# EAGLE schematic teensy_base (EAGLE 8.5.2)
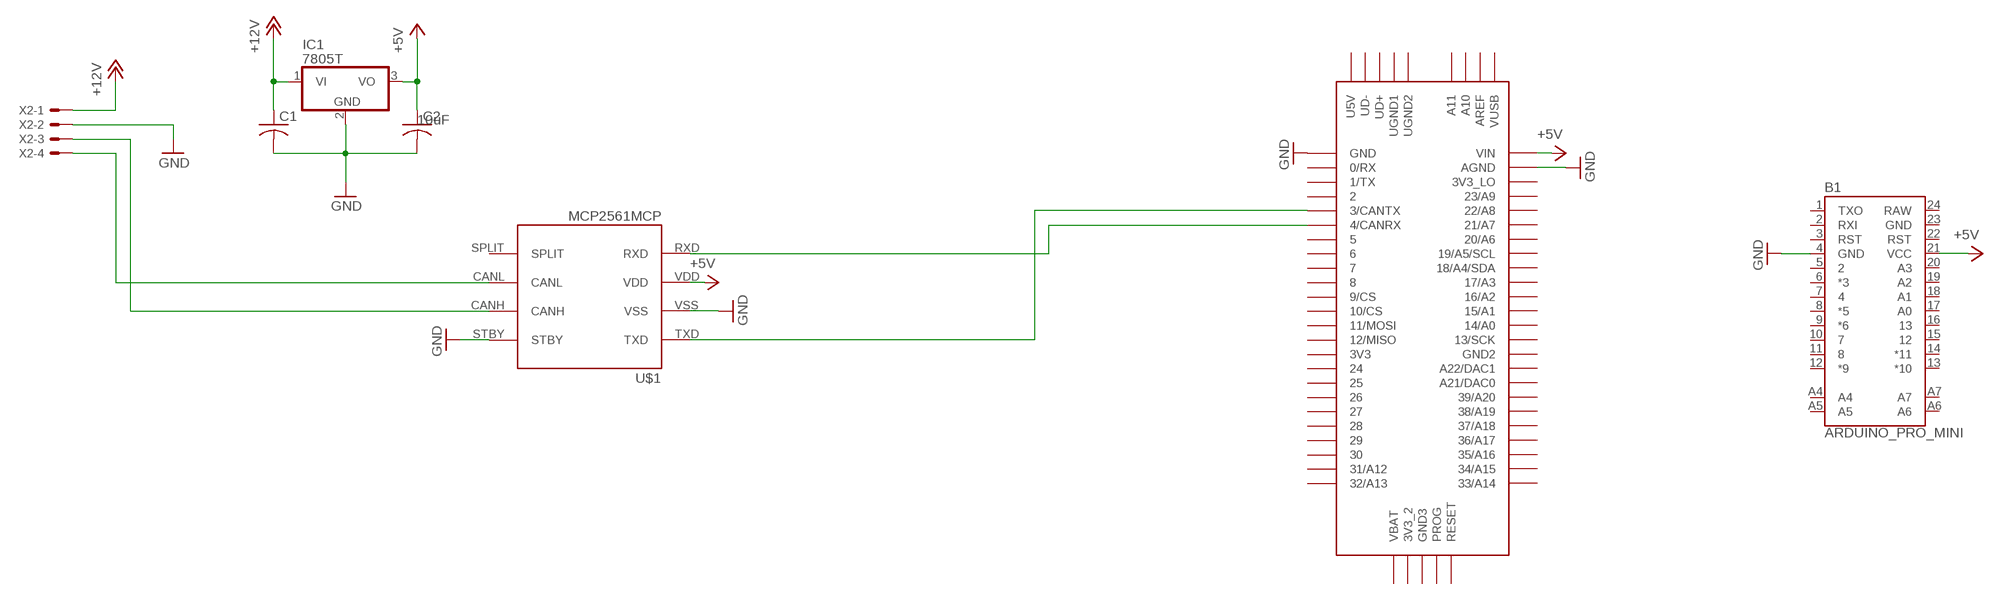
[diagram p0: schematic, sheet 1]

## Parts
B1  ARDUINO_PRO_MINI  [ARDUINO_PRO_MINI]
C1  C-USC1206  [C1206]
C2  C-USC1206  [C1206]
IC1  7805T  [TO220H]
U$1  MCP2561MCP  [MCP2561_PDIP]
U$2  TEENSY_3.5/3.6  [TEENSY_3.5/3.6]
X2  KK-156-4  [KK-156-4]

## Nets
+5V: B1.21(VCC) C2.1 IC1.3(VO) U$1.VDD U$2.VIN
+12V: C1.1 IC1.1(VI) X2.1
GND: B1.4(GND) C1.2 C2.2 IC1.2(GND) U$1.STBY U$1.VSS U$2.AGND U$2.GND X2.2
N$1: U$1.RXD U$2.4/CANRX
N$2: U$1.TXD U$2.3/CANTX
N$5: U$1.CANH X2.3
N$6: U$1.CANL X2.4
Unconnected: B1.1(TXO) B1.2(RXI) B1.3(RST) B1.5 B1.6(*3) B1.7 B1.8(*5) B1.9(*6) B1.10 B1.11 B1.12(*9) B1.13(*10) B1.14(*11) B1.15 B1.16 B1.17(A0) B1.18(A1) B1.19(A2) B1.20(A3) B1.22(RST) B1.A4 B1.A5 B1.A6 B1.A7 U$1.SPLIT U$2.0/RX U$2.1/TX U$2.2 U$2.3V3 U$2.3V3_2 U$2.3V3_LO U$2.5 U$2.6 U$2.7 U$2.8 U$2.9/CS U$2.10/CS U$2.11/MOSI U$2.12/MISO U$2.13/SCK U$2.14/A0 U$2.15/A1 U$2.16/A2 U$2.17/A3 U$2.18/A4/SDA U$2.19/A5/SCL U$2.20/A6 U$2.21/A7 U$2.21/DAC0(A21/DAC0) U$2.22/A8 U$2.23/A9 U$2.24 U$2.25 U$2.26 U$2.27 U$2.28 U$2.29 U$2.30 U$2.31/A12 U$2.32/A13 U$2.33/A14 U$2.34/A15 U$2.35/A16 U$2.36/A17 U$2.37/A18 U$2.38/A19 U$2.39/A20 U$2.A10 U$2.A11 U$2.A22/DAC1 U$2.AREF U$2.GND2 U$2.GND3 U$2.PROG U$2.RESET U$2.U5V U$2.UD+ U$2.UD- U$2.UGND1 U$2.UGND2 U$2.VBAT U$2.VUSB

## Power pins joined to a net without a drawn wire
GND: B1.23(GND)
RAW: B1.24(RAW)

## Library data of the parts
B1 = SparkFun-Boards:ARDUINO_PRO_MINI: SparkFun Pro Mini Pro Mini compatible footprint. Dimensions: 0.7 x 1.3" PCB Thickness: 0.8mm SparkFun Products: 3.3V/8MHz <https://www.sparkfun.com/products/11114> 5V/16MHz <https://www.sparkfun.com/products/11113>
C1 C2 = rcl:C-US: CAPACITOR, American symbol; CAPACITANCE: 10uF
IC1 = linear:78*: Positive VOLTAGE REGULATOR Source: http://cache.national.com/ds/LM/LM78L05.pdf http://www.fairchildsemi.com/ds/LM/LM7805.pdf
U$1 = PoJD:MCP2561: High-Speed CAN Transceiver See http://ww1.microchip.com/downloads/en/DeviceDoc/25167A.pdf The MCP2561/2 is a Microchip Technology Inc. second generation high-speed CAN transceiver. It serves as an interface between a CAN protocol controller and the physical two-wire CAN bus. The device meets the automotive requirements for high-speed (up to 1 Mb/s), low quiescent current, electromagnetic compatibility (EMC) and electrostatic discharge (ESD).
U$2 = Teensy356:TEENSY_3.5/3.6
X2 = con-molex:KK-156-4: KK 156 HEADER Source: http://www.molex.com/pdm_docs/sd/026604100_sd.pdf; OC_FARNELL: unknown; OC_NEWARK: unknown